# EAGLE design Power Supply 5V (EAGLE 6.2)
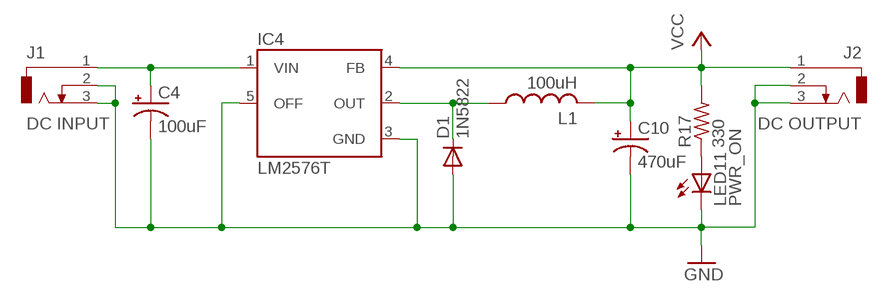
[diagram p0: schematic, sheet 1]

## Parts
C4  100uF  CPOL-USE2.5-6  [E2,5-6]
C10  470uF  CPOL-USE3.5-8  [E3,5-8]
D1  1N5822  1N5400  [DO201-15]
IC4  LM2576T  [TO220-5]
J1  DC INPUT  DCJ0202  [DCJ0202]
J2  DC OUTPUT  DCJ0202  [DCJ0202]
L1  100uH  L-USTJ3-U2  [TJ3-U2]
LED11  PWR_ON  LED3MM  [LED3MM]
R17  330  R-US_0207/10  [0207/10]

## Nets
GND [gnd]: C4.- C10.- D1.A IC4.3(GND) IC4.5(OFF) J1.2 J1.3 J2.2 J2.3 LED11.K(C)
N$4 [pwr]: C4.+ IC4.1(VIN) J1.1
N$32: D1.C IC4.2(OUT) L1.1
N$33: LED11.A R17.1
VCC [pwr]: C10.+ IC4.4(FB) J2.1 L1.2 R17.2

## Library data of the parts
C4 C10 = resistor:CPOL-US: POLARIZED CAPACITOR, American symbol
D1 = diode:1N5400: DIODE standard rectifier, 3 A, 50 V (Motorola)
IC4 = v-reg-3:LM2576: National Semiconductor <http://www.national.com> 3.0A "Simple Switcher"(c) 52kHz, Vout 1.23-37V (HV: 57V), Vin 40V (HV: 60V), 50µA standby current
J1 J2 = con-jack:DCJ0202: DC POWER JACK Source: DCJ0202.pdf; OC_FARNELL: unknown; OC_NEWARK: unknown
L1 = resistor:L-US: INDUCTOR, American symbol
LED11 = led:LED: LED OSRAM: - CHIPLED LG R971, LG N971, LY N971, LG Q971, LY Q971, LO R971, LY R971 LH N974, LH R974 LS Q976, LO Q976, LY Q976 LO Q996 - Hyper CHIPLED LW Q18S LB Q993, LB Q99A, LB R99A - SideLED LS A670, LO A670, LY A670, LG A670, LP A670 LB A673, LV A673, LT A673, LW A673 LH A674 LY A675 LS A676, LA A676, LO A676, LY A676, LW A676 LS A679, LY A679, LG A679 - Hyper Micro SIDELED® LS Y876, LA Y876, LO Y876, LY Y876 LT Y87S - SmartLED LW L88C, LW L88S LB L89C, LB L89S, LG L890 LS L89K, LO L89K, LY L89K LS L896, LA L896, LO L896, LY L896 - TOPLED LS T670, LO T670, LY T670, LG T670, LP T670 LSG T670, LSP T670, LSY T670, LOP T670, LYG T670 LG T671, LOG T671, LSG T671 LB T673, LV T673, LT T673, LW T673 LH T674 LS T676, LA T676, LO T676, LY T676, LB T676, LH T676, LSB T676, LW T676 LB T67C, LV T67C, LT T67C, LS T67K, LO T67K, LY T67K, LW E67C LS E67B, LA E67B, LO E67B, LY E67B, LB E67C, LV E67C, LT E67C LW T67C LS T679, LY T679, LG T679 LS T770, LO T770, LY T770, LG T770, LP T770 LB T773, LV T773, LT T773, LW T773 LH T774 LS E675, LA E675, LY E675, LS T675 LS T776, LA T776, LO T776, LY T776, LB T776 LHGB T686 LT T68C, LB T68C - Hyper Mini TOPLED® LB M676 - Mini TOPLED Santana® LG M470 LS M47K, LO M47K, LY M47K Source: http://www.osram.convergy.de LUXEON: - LUMILED® LXK2-PW12-R00, LXK2-PW12-S00, LXK2-PW14-U00, LXK2-PW14-V00 LXK2-PM12-R00, LXK2-PM12-S00, LXK2-PM14-U00 LXK2-PE12-Q00, LXK2-PE12-R00, LXK2-PE12-S00, LXK2-PE14-T00, LXK2-PE14-U00 LXK2-PB12-K00, LXK2-PB12-L00, LXK2-PB12-M00, LXK2-PB14-N00, LXK2-PB14-P00, LXK2-PB14-Q00 LXK2-PR12-L00, LXK2-PR12-M00, LXK2-PR14-Q00, LXK2-PR14-R00 LXK2-PD12-Q00, LXK2-PD12-R00, LXK2-PD12-S00 LXK2-PH12-R00, LXK2-PH12-S00 LXK2-PL12-P00, LXK2-PL12-Q00, LXK2-PL12-R00 Source: www.luxeon.com KINGBRIGHT: KA-3528ASYC Source: www.kingbright.com
R17 = resistor:R-US_: RESISTOR, American symbol

## Net classes
0 default: width 0.6 mm
1 pwr: width 1 mm
2 gnd: width 0.7 mm

## Board
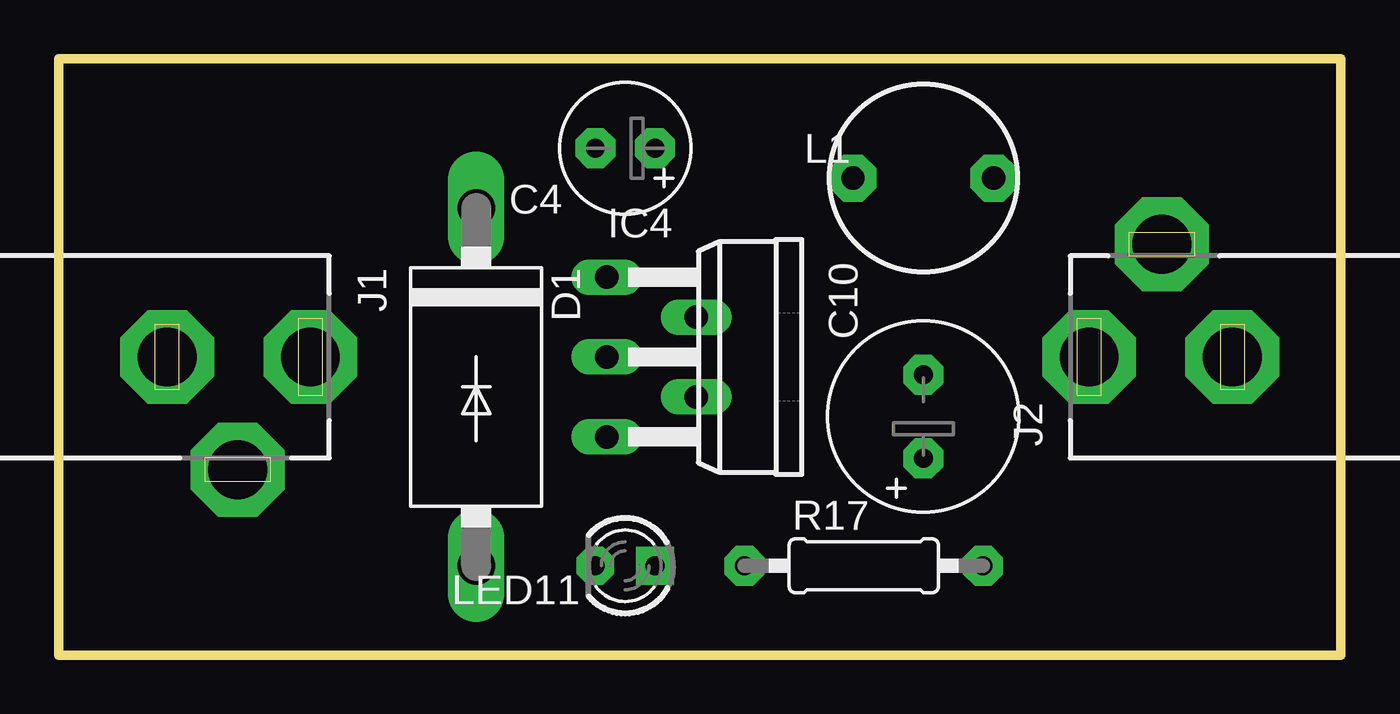
[diagram p1: board, top side]
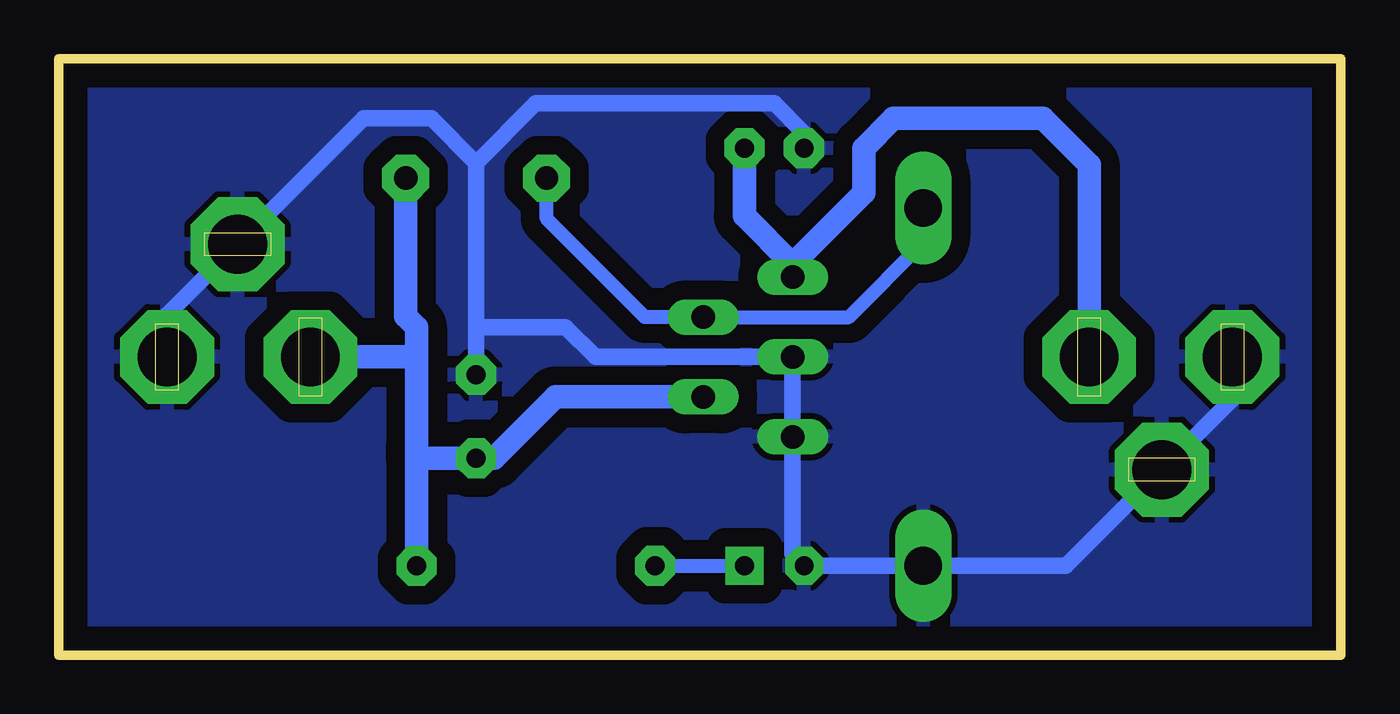
[diagram p2: board, bottom side, seen from below]

Size 54.61 x 25.4 mm. Coordinates in mm from the lower left corner, seen from the top.
Outline: 0,25.4 54.61,25.4 54.61,0 0,0 0,25.4
Copper layers (1*16): Top 0.035mm / dielectric 1.5mm / Bottom 0.035mm
Design rules: minimum track width 0.5mm, minimum drill 0.8mm, track to track 8mil, track to pad 8mil, pad to pad 8mil, via to via 8mil, smd to smd 8mil, copper to edge 40mil, drill to drill 8mil, minimum pad ring 10mil, minimum via ring 8mil, stop-mask expansion 4mil, vias tented up to drill 0mil, thermal gap 10mil

### Footprints (pad centres in the part's own frame; a part is rotated, then mirrored left to right if it is on the bottom)
E2,5-6 = drill 0.8 pad 1.7 octagon: + -1.27,0; - 1.27,0
E3,5-8 = drill 0.813 pad 1.7 octagon: + -1.778,0; - 1.778,0
DO201-15 = drill 1.6 long: A 7.62,0; C -7.62,0
TO220-5 = drill 1 long: 1 -3.4,-8.4; 2 -1.7,-4.59; 3 0,-8.4; 4 1.7,-4.59; 5 3.4,-8.4
DCJ0202 = drill 2.5 pad 4 octagon: 1 0,3.1; 2 4.8,0; 3 0,-3
TJ3-U2 = drill 1 pad 2 octagon: 1 -3,0; 2 3,0
LED3MM = drill 0.8 pad 1.6 square: A -1.27,0 | drill 0.8 pad 1.6 octagon: K 1.27,0
0207/10 = drill 0.8 pad 1.7 octagon: 1 -5.08,0; 2 5.08,0

### Placement (x,y rotation side)
C4  24.13,21.59 180 top
C10  36.83,10.16 90 top
D1  17.78,11.43 270 top
IC4  31.75,12.7 270 top
J1  7.62,12.7 270 top
J2  46.99,12.7 90 top
L1  36.83,20.32 0 top
LED11  24.13,3.81 180 top
R17  34.29,3.81 0 top

### Tracks (layer width: path | path; a pad name or v marks a point on that pad's centre or on a via)
GND
  Bottom 0.7: 36.83,13.97 33.02,13.97 31.75,12.7 IC4.3 IC4.5 23.35,4.3 LED11.K D1.A 11.71,3.81 J1.2 4.62,10.9 J1.3 | 36.83,20.95 38.73,22.86 41.63,22.86 J2.2 49.99,14.5 J2.3 | 36.83,20.95 36.83,13.97 | 36.83,13.97 C10.- | C4.- 22.86,22.23 24.13,23.49 34.29,23.49 36.83,20.95
  pour Bottom (isolate 0.8): 0,0 54.61,0 54.61,25.4 0,25.4
N$4
  Bottom 1: J1.1 10.72,20.88 12.7,22.86 19.05,22.86 20.32,21.59 20.32,19.68 23.35,16.66 | 23.35,16.66 IC4.1 | C4.+ 25.4,18.71 23.35,16.66
N$32
  Bottom 0.6: D1.C 17.78,17.57 20.95,14.4 IC4.2 29.64,14.4 33.83,18.59 L1.1
N$33
  Bottom 0.6: R17.1 LED11.A
VCC
  Bottom 1: L1.2 39.83,14.43 39.37,13.97 39.37,12.7 | 39.37,12.7 39.37,8.89 39.37,8.38 | 39.37,8.38 R17.2 | 39.37,12.7 J2.1 | IC4.4 33.45,11 36.07,8.38 C10.+ 39.37,8.38